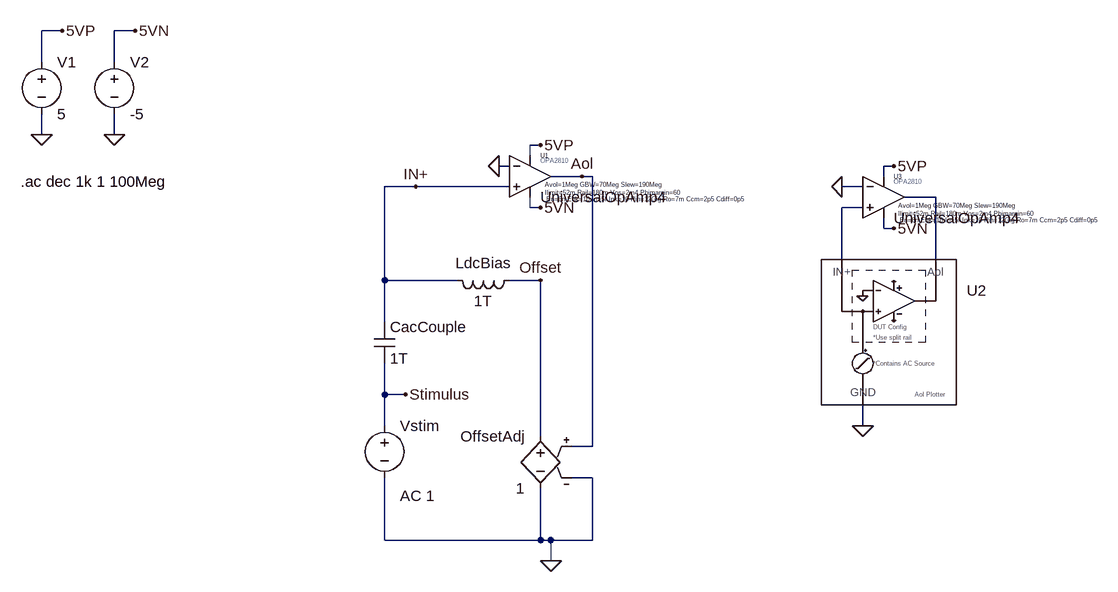
[diagram p0: schematic Aol_Test.asc]
Aol_Test.asc, the LTspice schematic file:
Version 4
SHEET 1 2332 1156
WIRE -464 -128 -496 -128
WIRE -352 -128 -384 -128
WIRE -496 -80 -496 -128
WIRE -384 -80 -384 -128
WIRE -496 32 -496 0
WIRE -384 32 -384 0
WIRE 272 48 256 48
WIRE 256 64 256 48
WIRE 224 80 208 80
WIRE 816 80 800 80
WIRE 336 96 288 96
WIRE 352 96 336 96
WIRE 800 96 800 80
WIRE 80 112 32 112
WIRE 224 112 80 112
WIRE 768 112 736 112
WIRE 880 128 832 128
WIRE 256 144 256 128
WIRE 272 144 256 144
WIRE 768 144 736 144
WIRE 800 176 800 160
WIRE 816 176 800 176
WIRE 736 224 736 144
WIRE 880 224 880 128
WIRE 32 256 32 112
WIRE 144 256 32 256
WIRE 272 256 224 256
WIRE 32 320 32 256
WIRE 32 432 32 384
WIRE 64 432 32 432
WIRE 32 480 32 432
WIRE 768 480 768 448
WIRE 272 496 272 256
WIRE 352 512 352 96
WIRE 352 512 320 512
WIRE 352 560 320 560
WIRE 32 656 32 560
WIRE 272 656 272 576
WIRE 272 656 32 656
WIRE 288 656 272 656
WIRE 352 656 352 560
WIRE 352 656 288 656
WIRE 288 688 288 656
FLAG 336 96 Aol
FLAG 80 112 IN+
FLAG 288 688 0
FLAG 272 256 Offset
FLAG 64 432 Stimulus
FLAG -496 32 0
FLAG -464 -128 5VP
FLAG -384 32 0
FLAG -352 -128 5VN
FLAG 272 48 5VP
FLAG 272 144 5VN
FLAG 816 80 5VP
FLAG 816 176 5VN
FLAG 736 112 0
FLAG 208 80 0
FLAG 768 480 0
SYMBOL ind 240 240 R90
WINDOW 0 5 56 VBottom 2
WINDOW 3 32 56 VTop 2
SYMATTR InstName LdcBias
SYMATTR Value 1T
SYMATTR SpiceLine Rser=10m
SYMBOL cap 16 320 R0
SYMATTR InstName CacCouple
SYMATTR Value 1T
SYMBOL voltage 32 464 R0
WINDOW 123 24 124 Left 2
WINDOW 39 0 0 Left 0
SYMATTR Value2 AC 1
SYMATTR InstName Vstim
SYMATTR Value ""
SYMBOL e 272 480 M0
SYMATTR InstName OffsetAdj
SYMATTR Value 1
SYMBOL OpAmps\\UniversalOpAmp4 256 96 R0
WINDOW 0 16 -32 Left 0
WINDOW 123 23 13 Left 0
WINDOW 39 23 25 Left 0
WINDOW 40 25 35 Left 0
SYMATTR InstName U1
SYMATTR Value2 Avol=1Meg GBW=70Meg Slew=190Meg
SYMATTR SpiceLine Ilimit=52m Rail=180m Vos=2m4 Phimargin=60
SYMATTR SpiceLine2 En=6n Enk=10 In=5f Ink=10 Rin=12Gig Ro=7m Ccm=2p5 Cdiff=0p5
SYMBOL voltage -496 -96 R0
WINDOW 123 0 0 Left 0
WINDOW 39 0 0 Left 0
SYMATTR InstName V1
SYMATTR Value 5
SYMBOL voltage -384 -96 R0
WINDOW 123 0 0 Left 0
WINDOW 39 0 0 Left 0
SYMATTR InstName V2
SYMATTR Value -5
SYMBOL Aol 816 288 R0
SYMATTR InstName U2
SYMBOL OpAmps\\UniversalOpAmp4 800 128 R0
WINDOW 0 16 -32 Left 0
WINDOW 123 23 13 Left 0
WINDOW 39 23 25 Left 0
WINDOW 40 25 35 Left 0
SYMATTR InstName U3
SYMATTR Value2 Avol=1Meg GBW=70Meg Slew=190Meg
SYMATTR SpiceLine Ilimit=52m Rail=180m Vos=2m4 Phimargin=60
SYMATTR SpiceLine2 En=6n Enk=10 In=5f Ink=10 Rin=12Gig Ro=7m Ccm=2p5 Cdiff=0p5
TEXT -528 104 Left 2 !.ac dec 1k 1 100Meg
TEXT 272 72 Left 0 ;OPA2810
TEXT 816 104 Left 0 ;OPA2810

The netlist it stands for:
* Aol_Test.asc
LdcBias Offset IN+ 1T Rser=10m
CacCouple IN+ Stimulus 1T
Vstim Stimulus 0 AC 1
E§OffsetAdj Offset 0 Aol 0 1
* U1: UniversalOpAmp4 Avol=1Meg GBW=70Meg Slew=190Meg Ilimit=52m Rail=180m Vos=2m4 Phimargin=60 En=6n Enk=10 In=5f Ink=10 Rin=12Gig Ro=7m Ccm=2p5 Cdiff=0p5 (symbol OpAmps\UniversalOpAmp4 not available, pins judged from their places): In+=IN+ In-=0 V+=5VP V-=5VN OUT=Aol
V1 5VP 0 5
V2 5VN 0 -5
XU2 N002 N001 0 Aol  ; pins IN+ Aol GND
* U3: UniversalOpAmp4 Avol=1Meg GBW=70Meg Slew=190Meg Ilimit=52m Rail=180m Vos=2m4 Phimargin=60 En=6n Enk=10 In=5f Ink=10 Rin=12Gig Ro=7m Ccm=2p5 Cdiff=0p5 (symbol OpAmps\UniversalOpAmp4 not available, pins judged from their places): In+=N002 In-=0 V+=5VP V-=5VN OUT=N001
.ac dec 1k 1 100Meg
* OPA2810
* OPA2810
.lib Aol.lib
.backanno
.end